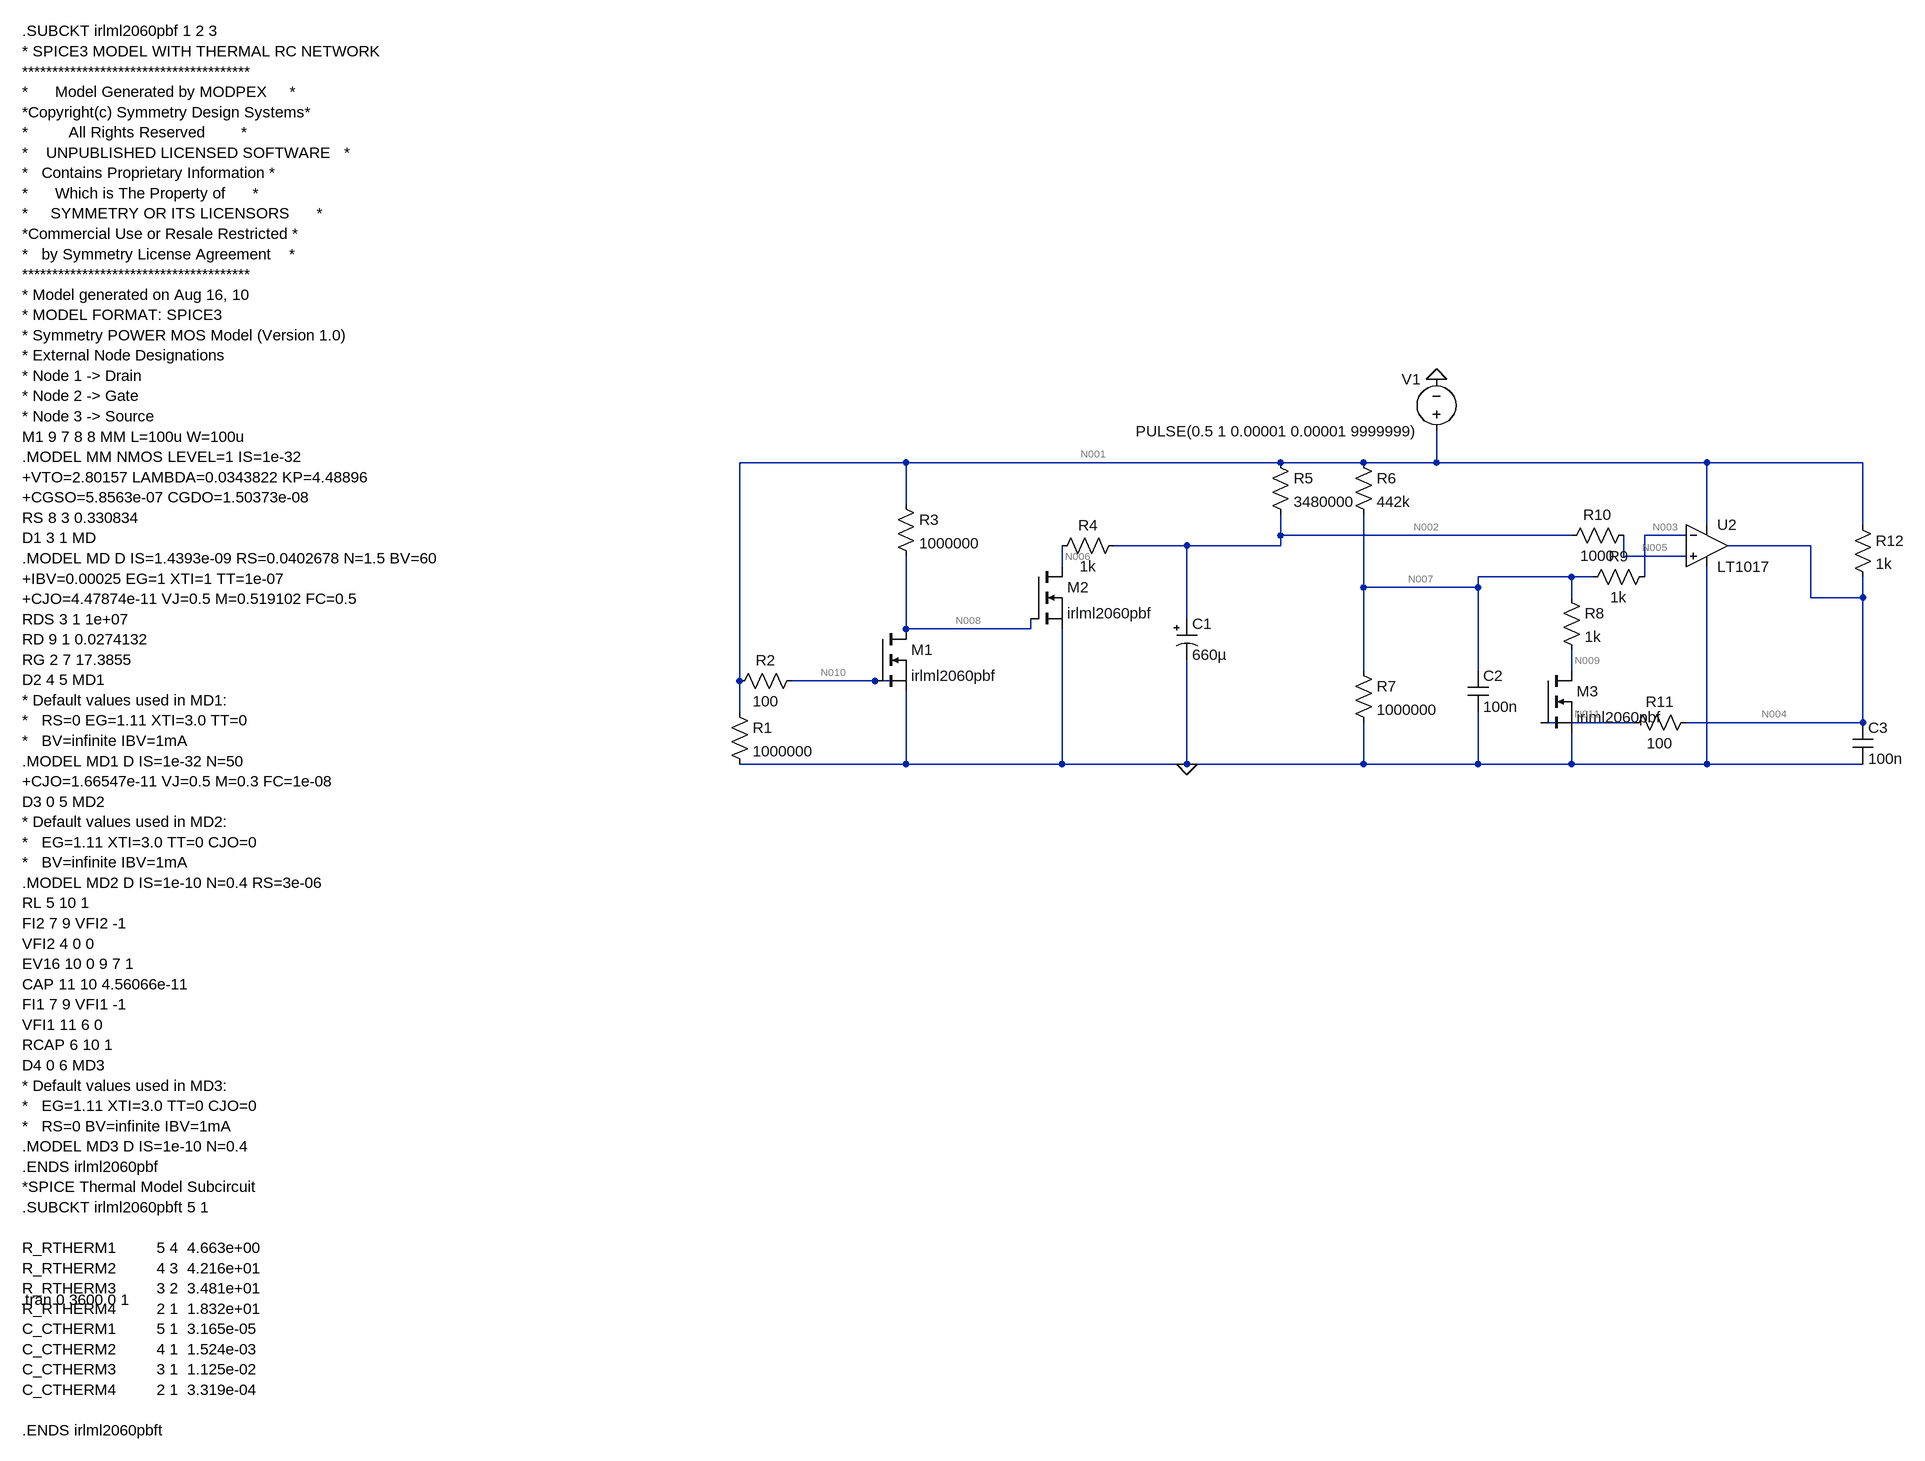
[diagram p0: schematic timer_simulation.asc]
timer_simulation.asc, the LTspice schematic file:
Version 4
SHEET 1 2572 840
WIRE -448 -464 -704 -464
WIRE 128 -464 -448 -464
WIRE 256 -464 128 -464
WIRE 368 -464 368 -512
WIRE 368 -464 256 -464
WIRE 784 -464 368 -464
WIRE 1024 -464 784 -464
WIRE -448 -400 -448 -464
WIRE 784 -368 784 -464
WIRE 1024 -368 1024 -464
WIRE 128 -352 128 -384
WIRE 576 -352 128 -352
WIRE 752 -352 688 -352
WIRE -16 -336 -128 -336
WIRE 128 -336 128 -352
WIRE 128 -336 -16 -336
WIRE 944 -336 816 -336
WIRE 656 -320 656 -352
WIRE 752 -320 656 -320
WIRE -208 -304 -208 -336
WIRE 576 -288 432 -288
WIRE 608 -288 576 -288
WIRE 688 -288 688 -352
WIRE 256 -272 256 -384
WIRE 432 -272 432 -288
WIRE 432 -272 256 -272
WIRE 576 -256 576 -288
WIRE 944 -256 944 -336
WIRE 1024 -256 1024 -288
WIRE 1024 -256 944 -256
WIRE -16 -224 -16 -336
WIRE -448 -208 -448 -320
WIRE -256 -208 -256 -224
WIRE -256 -208 -448 -208
WIRE 256 -144 256 -272
WIRE 432 -144 432 -272
WIRE 576 -144 576 -176
WIRE -704 -128 -704 -464
WIRE -496 -128 -624 -128
WIRE -448 -128 -496 -128
WIRE -704 -80 -704 -128
WIRE 672 -64 528 -64
WIRE 1024 -64 1024 -256
WIRE 1024 -64 752 -64
WIRE -448 0 -448 -112
WIRE -448 0 -704 0
WIRE -208 0 -208 -208
WIRE -208 0 -448 0
WIRE -16 0 -16 -160
WIRE -16 0 -208 0
WIRE 256 0 256 -64
WIRE 256 0 -16 0
WIRE 432 0 432 -80
WIRE 432 0 256 0
WIRE 576 0 576 -48
WIRE 576 0 432 0
WIRE 784 0 784 -304
WIRE 784 0 576 0
WIRE 1024 0 784 0
FLAG -16 0 0
FLAG 368 -592 0
SYMBOL nmos -496 -208 R0
SYMATTR InstName M1
SYMATTR Value irlml2060pbf
SYMATTR Prefix X
SYMBOL res -720 -96 R0
SYMATTR InstName R1
SYMATTR Value 1000000
SYMBOL res -608 -144 R90
WINDOW 0 0 56 VBottom 2
WINDOW 3 32 56 VTop 2
SYMATTR InstName R2
SYMATTR Value 100
SYMBOL res -464 -416 R0
SYMATTR InstName R3
SYMATTR Value 1000000
SYMBOL nmos -256 -304 R0
SYMATTR InstName M2
SYMATTR Value irlml2060pbf
SYMATTR Prefix X
SYMBOL res -112 -352 R90
WINDOW 0 0 56 VBottom 2
WINDOW 3 32 56 VTop 2
SYMATTR InstName R4
SYMATTR Value 1k
SYMBOL polcap -32 -224 R0
SYMATTR InstName C1
SYMATTR Value 660µ
SYMBOL res 112 -480 R0
SYMATTR InstName R5
SYMATTR Value 3480000
SYMBOL res 240 -480 R0
SYMATTR InstName R6
SYMATTR Value 442k
SYMBOL cap 416 -144 R0
SYMATTR InstName C2
SYMATTR Value 100n
SYMBOL res 240 -160 R0
SYMATTR InstName R7
SYMATTR Value 1000000
SYMBOL res 560 -272 R0
SYMATTR InstName R8
SYMATTR Value 1k
SYMBOL res 672 -368 R90
WINDOW 0 0 56 VBottom 2
WINDOW 3 32 56 VTop 2
SYMATTR InstName R10
SYMATTR Value 1000
SYMBOL nmos 528 -144 R0
SYMATTR InstName M3
SYMATTR Value irlml2060pbf
SYMATTR Prefix X
SYMBOL res 768 -80 R90
WINDOW 0 0 56 VBottom 2
WINDOW 3 32 56 VTop 2
SYMATTR InstName R11
SYMATTR Value 100
SYMBOL cap 1008 -64 R0
SYMATTR InstName C3
SYMATTR Value 100n
SYMBOL res 1008 -384 R0
SYMATTR InstName R12
SYMATTR Value 1k
SYMBOL voltage 368 -496 R180
WINDOW 0 24 96 Left 2
WINDOW 3 24 16 Left 2
WINDOW 123 0 0 Left 0
WINDOW 39 0 0 Left 0
SYMATTR InstName V1
SYMATTR Value PULSE(0.5 1 0.00001 0.00001 9999999)
SYMBOL res 704 -304 R90
WINDOW 0 0 56 VBottom 2
WINDOW 3 32 56 VTop 2
SYMATTR InstName R9
SYMATTR Value 1k
SYMBOL Comparators\\LT1017 784 -336 R0
SYMATTR InstName U2
TEXT -1808 -1128 Left 2 !.SUBCKT irlml2060pbf 1 2 3\n* SPICE3 MODEL WITH THERMAL RC NETWORK\n**************************************\n*      Model Generated by MODPEX     *\n*Copyright(c) Symmetry Design Systems*\n*         All Rights Reserved        *\n*    UNPUBLISHED LICENSED SOFTWARE   *\n*   Contains Proprietary Information *\n*      Which is The Property of      *\n*     SYMMETRY OR ITS LICENSORS      *\n*Commercial Use or Resale Restricted *\n*   by Symmetry License Agreement    *\n**************************************\n* Model generated on Aug 16, 10\n* MODEL FORMAT: SPICE3\n* Symmetry POWER MOS Model (Version 1.0)\n* External Node Designations\n* Node 1 -> Drain\n* Node 2 -> Gate\n* Node 3 -> Source\nM1 9 7 8 8 MM L=100u W=100u\n.MODEL MM NMOS LEVEL=1 IS=1e-32\n+VTO=2.80157 LAMBDA=0.0343822 KP=4.48896\n+CGSO=5.8563e-07 CGDO=1.50373e-08\nRS 8 3 0.330834\nD1 3 1 MD\n.MODEL MD D IS=1.4393e-09 RS=0.0402678 N=1.5 BV=60\n+IBV=0.00025 EG=1 XTI=1 TT=1e-07\n+CJO=4.47874e-11 VJ=0.5 M=0.519102 FC=0.5\nRDS 3 1 1e+07\nRD 9 1 0.0274132\nRG 2 7 17.3855\nD2 4 5 MD1\n* Default values used in MD1:\n*   RS=0 EG=1.11 XTI=3.0 TT=0\n*   BV=infinite IBV=1mA\n.MODEL MD1 D IS=1e-32 N=50\n+CJO=1.66547e-11 VJ=0.5 M=0.3 FC=1e-08\nD3 0 5 MD2\n* Default values used in MD2:\n*   EG=1.11 XTI=3.0 TT=0 CJO=0\n*   BV=infinite IBV=1mA\n.MODEL MD2 D IS=1e-10 N=0.4 RS=3e-06\nRL 5 10 1\nFI2 7 9 VFI2 -1\nVFI2 4 0 0\nEV16 10 0 9 7 1\nCAP 11 10 4.56066e-11\nFI1 7 9 VFI1 -1\nVFI1 11 6 0\nRCAP 6 10 1\nD4 0 6 MD3\n* Default values used in MD3:\n*   EG=1.11 XTI=3.0 TT=0 CJO=0\n*   RS=0 BV=infinite IBV=1mA\n.MODEL MD3 D IS=1e-10 N=0.4\n.ENDS irlml2060pbf\n*SPICE Thermal Model Subcircuit\n.SUBCKT irlml2060pbft 5 1\n \nR_RTHERM1         5 4  4.663e+00\nR_RTHERM2         4 3  4.216e+01\nR_RTHERM3         3 2  3.481e+01\nR_RTHERM4         2 1  1.832e+01\nC_CTHERM1         5 1  3.165e-05\nC_CTHERM2         4 1  1.524e-03\nC_CTHERM3         3 1  1.125e-02\nC_CTHERM4         2 1  3.319e-04\n \n.ENDS irlml2060pbft
TEXT -1810 824 Left 2 !.tran 0 3600 0 1

The netlist it stands for:
* timer_simulation.asc
XM1 N008 N010 0 irlml2060pbf  ; pins D G S
R1 N001 0 1000000
R2 N010 N001 100
R3 N001 N008 1000000
XM2 N006 N008 0 irlml2060pbf  ; pins D G S
R4 N002 N006 1k
C1 N002 0 660µ
R5 N001 N002 3480000
R6 N001 N007 442k
C2 N007 0 100n
R7 N007 0 1000000
R8 N007 N009 1k
R10 N005 N002 1000
XM3 N009 N011 0 irlml2060pbf  ; pins D G S
R11 N004 N011 100
C3 N004 0 100n
R12 N001 N004 1k
V1 N001 0 PULSE(0.5 1 0.00001 0.00001 9999999)
R9 N003 N007 1k
XU2 N005 N003 N001 0 N004 LT1017  ; pins In+ In- V+ V- OUT
.SUBCKT irlml2060pbf 1 2 3
* SPICE3 MODEL WITH THERMAL RC NETWORK
**************************************
*      Model Generated by MODPEX     *
*Copyright(c) Symmetry Design Systems*
*         All Rights Reserved        *
*    UNPUBLISHED LICENSED SOFTWARE   *
*   Contains Proprietary Information *
*      Which is The Property of      *
*     SYMMETRY OR ITS LICENSORS      *
*Commercial Use or Resale Restricted *
*   by Symmetry License Agreement    *
**************************************
* Model generated on Aug 16, 10
* MODEL FORMAT: SPICE3
* Symmetry POWER MOS Model (Version 1.0)
* External Node Designations
* Node 1 -> Drain
* Node 2 -> Gate
* Node 3 -> Source
M1 9 7 8 8 MM L=100u W=100u
.MODEL MM NMOS LEVEL=1 IS=1e-32
+VTO=2.80157 LAMBDA=0.0343822 KP=4.48896
+CGSO=5.8563e-07 CGDO=1.50373e-08
RS 8 3 0.330834
D1 3 1 MD
.MODEL MD D IS=1.4393e-09 RS=0.0402678 N=1.5 BV=60
+IBV=0.00025 EG=1 XTI=1 TT=1e-07
+CJO=4.47874e-11 VJ=0.5 M=0.519102 FC=0.5
RDS 3 1 1e+07
RD 9 1 0.0274132
RG 2 7 17.3855
D2 4 5 MD1
* Default values used in MD1:
*   RS=0 EG=1.11 XTI=3.0 TT=0
*   BV=infinite IBV=1mA
.MODEL MD1 D IS=1e-32 N=50
+CJO=1.66547e-11 VJ=0.5 M=0.3 FC=1e-08
D3 0 5 MD2
* Default values used in MD2:
*   EG=1.11 XTI=3.0 TT=0 CJO=0
*   BV=infinite IBV=1mA
.MODEL MD2 D IS=1e-10 N=0.4 RS=3e-06
RL 5 10 1
FI2 7 9 VFI2 -1
VFI2 4 0 0
EV16 10 0 9 7 1
CAP 11 10 4.56066e-11
FI1 7 9 VFI1 -1
VFI1 11 6 0
RCAP 6 10 1
D4 0 6 MD3
* Default values used in MD3:
*   EG=1.11 XTI=3.0 TT=0 CJO=0
*   RS=0 BV=infinite IBV=1mA
.MODEL MD3 D IS=1e-10 N=0.4
.ENDS irlml2060pbf
*SPICE Thermal Model Subcircuit
.SUBCKT irlml2060pbft 5 1
R_RTHERM1         5 4  4.663e+00
R_RTHERM2         4 3  4.216e+01
R_RTHERM3         3 2  3.481e+01
R_RTHERM4         2 1  1.832e+01
C_CTHERM1         5 1  3.165e-05
C_CTHERM2         4 1  1.524e-03
C_CTHERM3         3 1  1.125e-02
C_CTHERM4         2 1  3.319e-04
.ENDS irlml2060pbft
.tran 0 3600 0 1
.backanno
.end

* Results of the author's LTspice run, read from the files saved beside the schematic
* Operating Point, zero values left out:
*   V(n008) = 453.2 mV
*   V(n010) = 500 mV
*   V(n001) = 500 mV
*   V(n006) = 363.8 mV
*   V(n002) = 363.8 mV
*   V(n007) = 336.4 mV
*   V(n009) = 336.3 mV
*   V(n005) = 363.8 mV
*   V(n011) = 51.55 mV
*   V(n004) = 51.55 mV
*   V(n003) = 336.4 mV
*   I(R9) = 1.249 nA
*   I(R12) = 448.4 µA
*   I(R10) = -1.319 nA
*   I(R8) = 35.07 nA
*   I(R7) = 336.4 nA
*   I(R6) = 370.2 nA
*   I(R5) = 39.14 nA
*   I(R4) = 37.82 nA
*   I(R3) = 46.76 nA
*   I(R1) = 500 nA
*   I(V1) = -552.4 µA
*   Ix(m1:1) = 46.76 nA
*   Ix(m1:3) = -46.76 nA
*   Ix(m2:1) = 37.82 nA
*   Ix(m2:3) = -37.82 nA
*   Ix(m3:1) = 35.07 nA
*   Ix(m3:3) = -35.07 nA
*   Ix(u2:1) = 1.319 nA
*   Ix(u2:2) = -1.249 nA
*   Ix(u2:3) = 103 µA
*   Ix(u2:4) = -551.5 µA
*   Ix(u2:5) = 448.4 µA
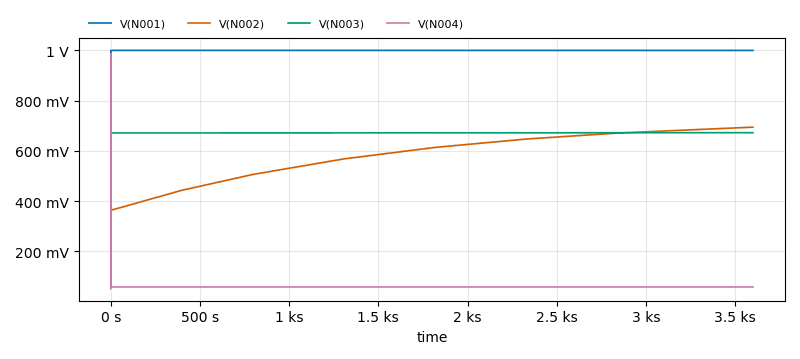
[diagram p1: Transient Analysis of timer_simulation.asc, plotted from the saved traces]
* Transient Analysis, 1 run:
*   V(N001): min 500 mV, max 1 V, average 999.9 mV, rms 999.9 mV, last 999.8 mV
*   V(N002): min 363.8 mV, max 694.6 mV, average 584.5 mV, rms 592.2 mV, last 694.6 mV
*   V(N003): min 336.4 mV, max 672.6 mV, average 671.8 mV, rms 671.9 mV, last 672.6 mV
*   V(N004): min 51.55 mV, max 985.3 mV, average 58.82 mV, rms 58.83 mV, last 58.82 mV